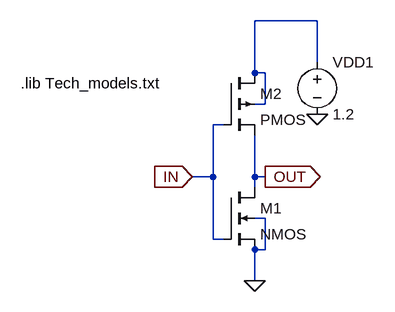
[diagram p0: schematic inverter.asc]
inverter.asc, the LTspice schematic file:
Version 4
SHEET 1 880 680
WIRE 320 -80 224 -80
WIRE 320 -16 320 -80
WIRE 224 0 224 -80
WIRE 240 0 224 0
WIRE 240 48 240 0
WIRE 240 48 224 48
WIRE 176 80 160 80
WIRE 160 160 160 80
WIRE 160 160 128 160
WIRE 224 160 224 96
WIRE 240 160 224 160
WIRE 224 176 224 160
WIRE 240 224 224 224
WIRE 160 256 160 160
WIRE 176 256 160 256
WIRE 240 272 240 224
WIRE 240 272 224 272
WIRE 224 320 224 272
FLAG 224 320 0
FLAG 128 160 IN
IOPIN 128 160 In
FLAG 240 160 OUT
IOPIN 240 160 Out
FLAG 320 64 0
SYMBOL nmos4 176 176 R0
SYMATTR InstName M1
SYMATTR Value2 l=32n w=64n
SYMBOL pmos4 176 0 R0
SYMATTR InstName M2
SYMATTR Value2 l=32n w=64n
SYMBOL voltage 320 -32 R0
SYMATTR InstName VDD1
SYMATTR Value 1.2
TEXT -136 16 Left 2 !.lib Tech_models.txt

The netlist it stands for:
* inverter.asc
M1 OUT IN 0 0 NMOS l=32n w=64n
M2 N001 IN OUT N001 PMOS l=32n w=64n
VDD1 N001 0 1.2
.model NMOS NMOS
.model PMOS PMOS
.lib standard.mos
.lib Tech_models.txt
.backanno
.end